# EasyEDA Pro project Custom PCB Keychain.epro

# Board PCB1
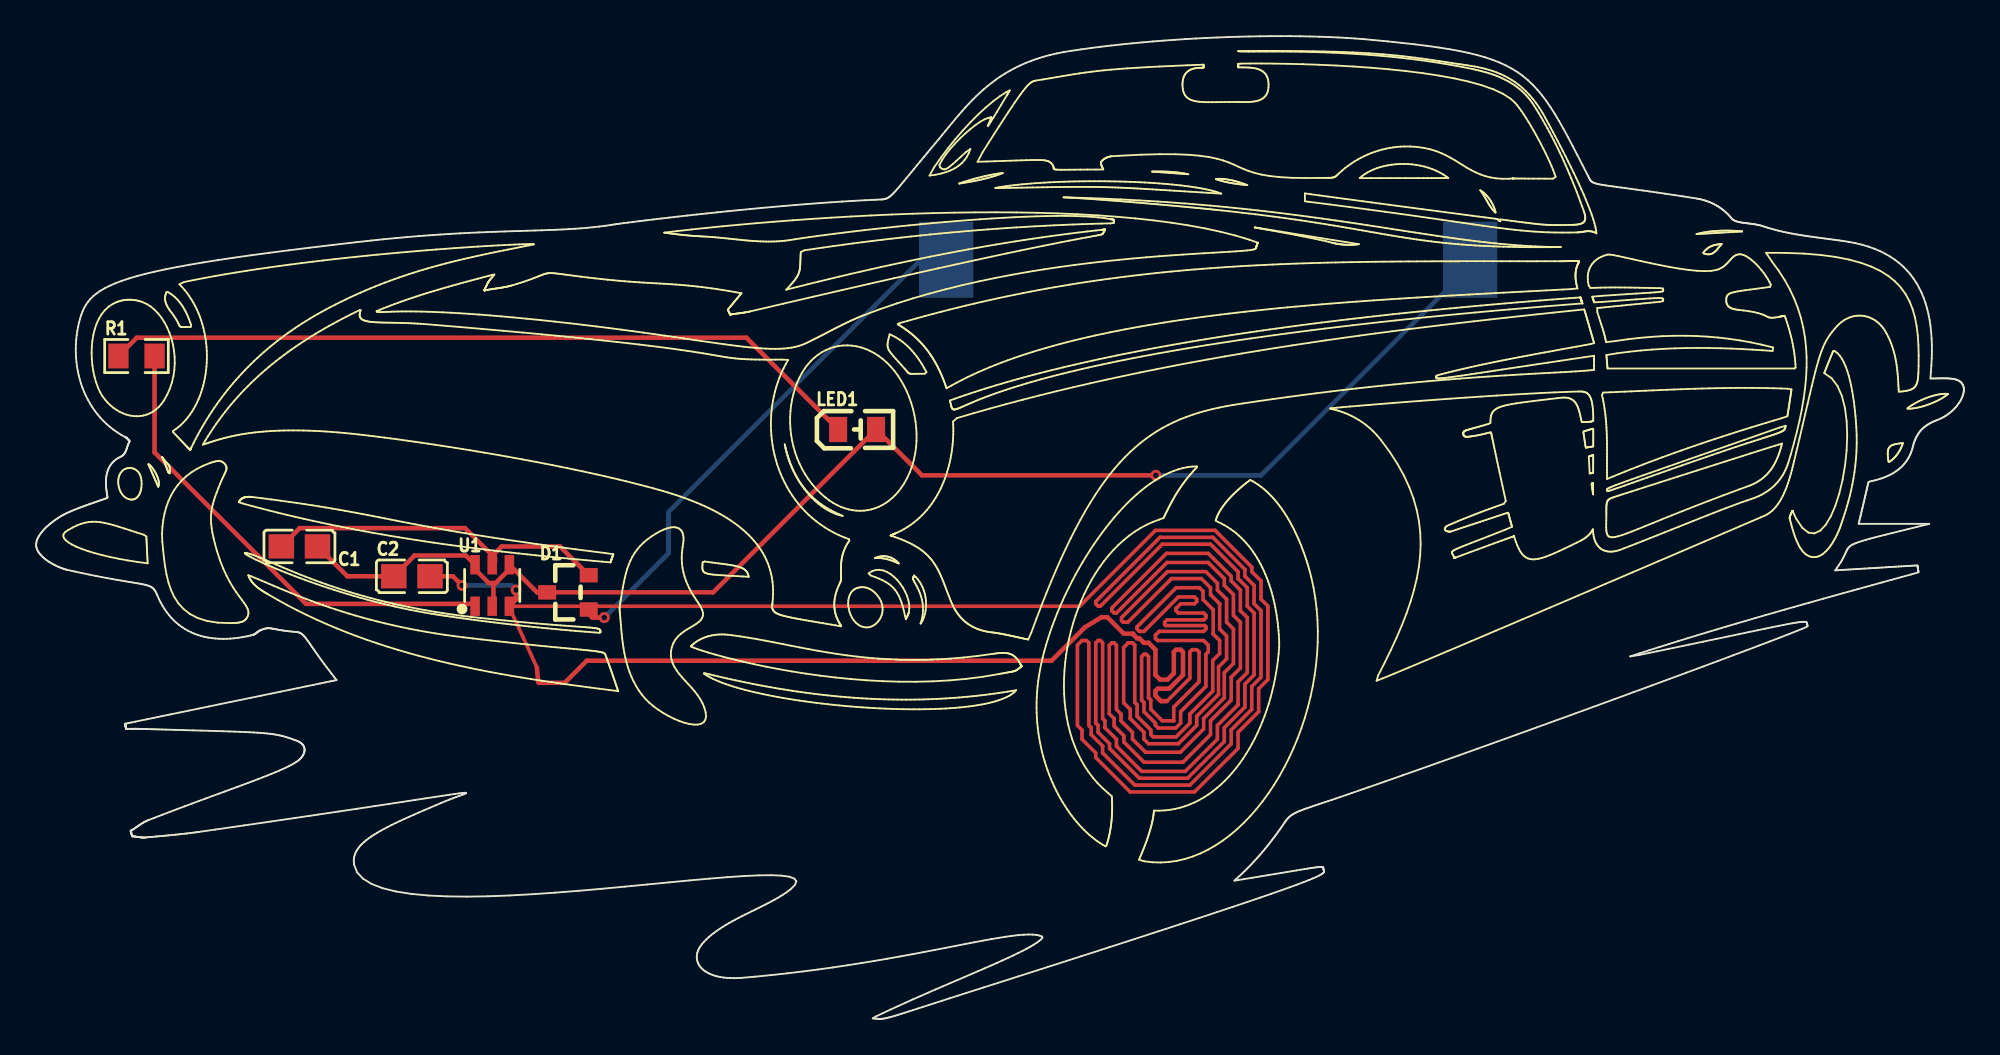
[diagram p0: board, top side]
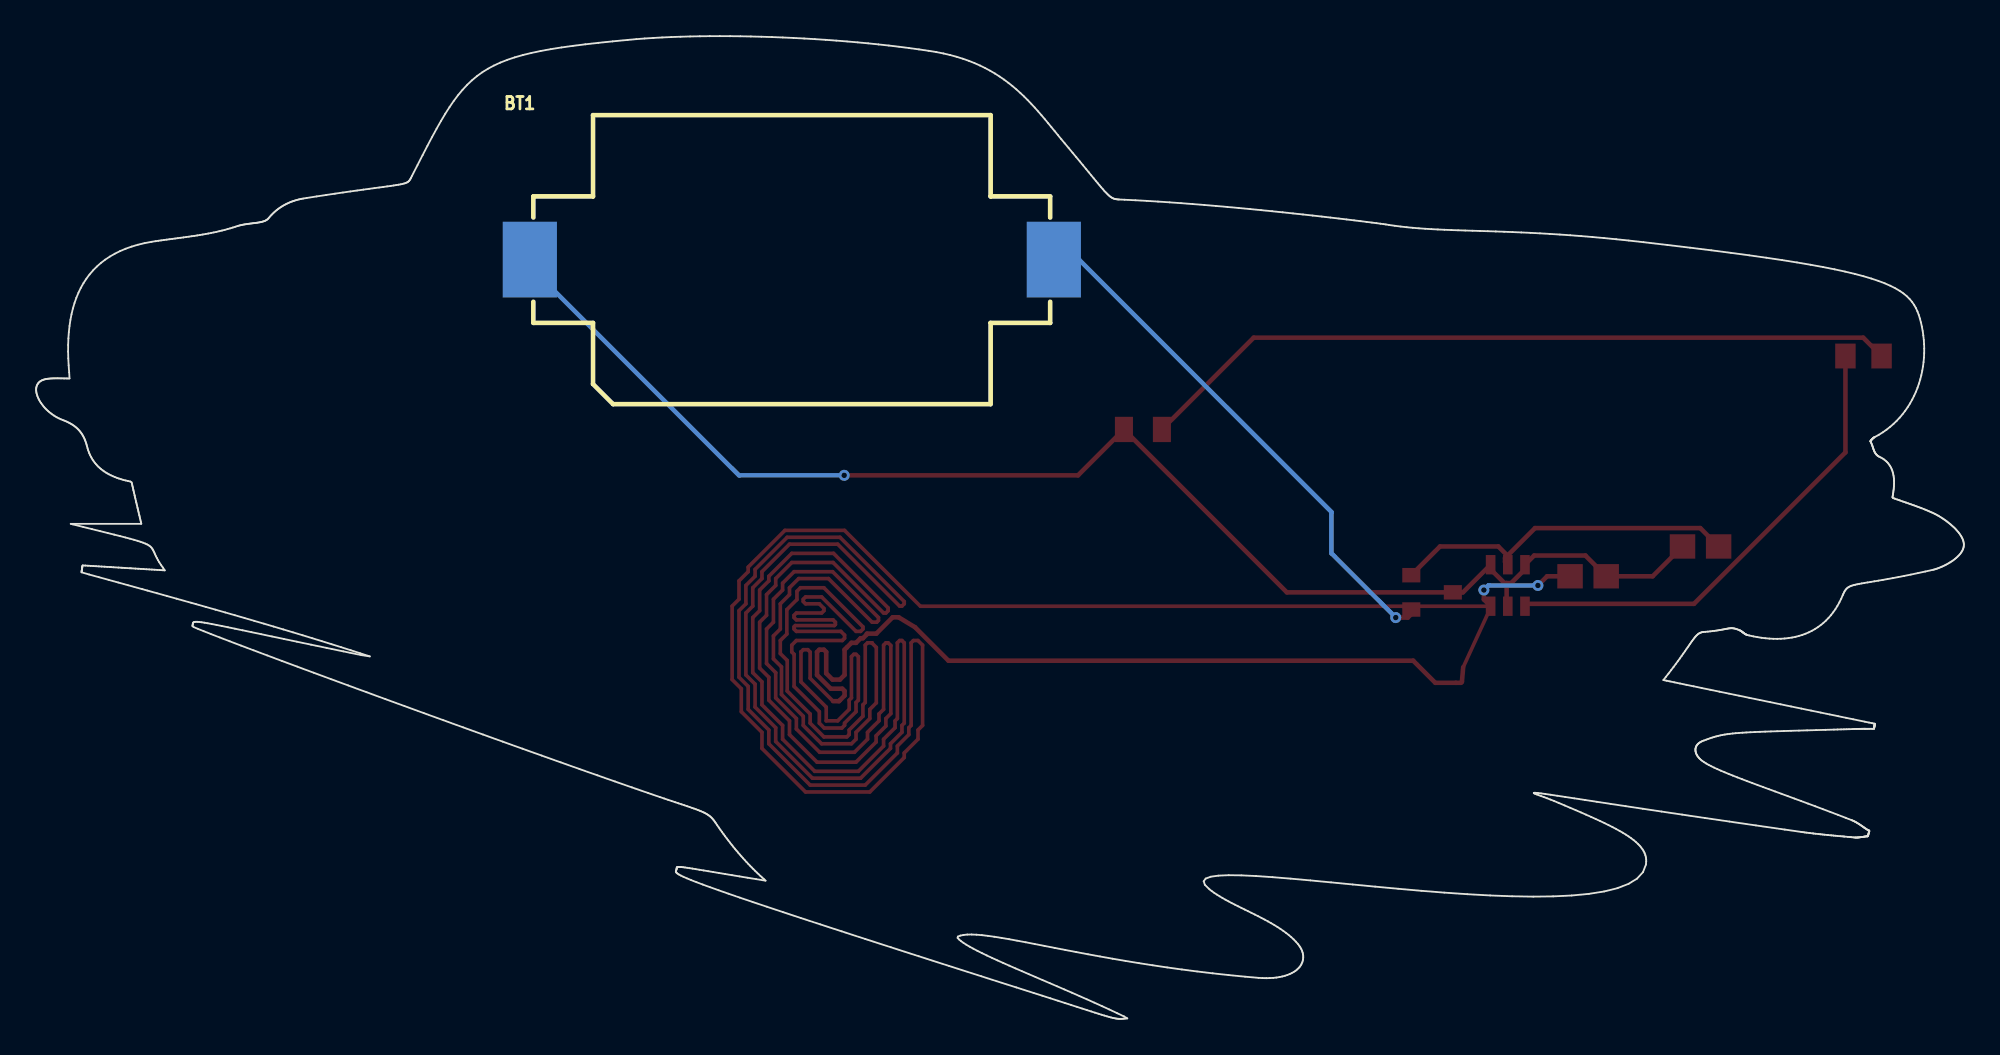
[diagram p1: board, bottom side, seen from below]

Outline 106.68 x 54.4 mm; copper layers: Top Layer, Bottom Layer. Coordinates in mm from the lower left corner of the outline.
Outline path: 0,26.24 0,26.17 0.02,26.1 0.03,26.04 0.06,25.97 0.09,25.91 0.12,25.85 0.16,25.79 0.21,25.73 0.26,25.67 0.31,25.62 0.37,25.56 0.43,25.51 0.5,25.45 0.56,25.4 0.63,25.35 0.7,25.31 0.77,25.26 0.84,25.22 0.92,25.18 0.99,25.14 1.06,25.1 1.14,25.06 1.21,25.03 1.28,25 1.35,24.97 1.42,24.95 1.48,24.92 1.54,24.9 1.6,24.88 1.66,24.87 1.71,24.86 2.13,24.76 2.55,24.67 2.94,24.59 3.29,24.52 3.63,24.45 3.94,24.39 4.22,24.34 4.49,24.3 4.73,24.26 4.95,24.22 5.33,24.16 5.5,24.13 5.65,24.1 5.78,24.08 5.9,24.05 6.01,24.03 6.11,24.01 6.19,23.98 6.27,23.95 6.33,23.92 6.39,23.89 6.44,23.86 6.49,23.81 6.53,23.77 6.57,23.72 6.6,23.66 6.64,23.59 6.67,23.52 6.71,23.44 6.79,23.26 6.89,23.05 7,22.86 7.11,22.67 7.23,22.5 7.36,22.34 7.49,22.19 7.63,22.05 7.78,21.91 7.93,21.79 8.08,21.68 8.24,21.57 8.41,21.48 8.58,21.39 8.76,21.32 8.94,21.25 9.13,21.19 9.32,21.15 9.51,21.11 9.71,21.08 9.91,21.05 10.12,21.04 10.33,21.03 10.54,21.04 10.76,21.05 10.98,21.07 11.2,21.09 11.42,21.13 11.65,21.17 11.88,21.22 11.97,21.24 11.99,21.25 12.01,21.26 12.04,21.27 12.06,21.28 12.09,21.29 12.1,21.3 12.13,21.32 12.17,21.35 12.22,21.38 12.23,21.39 12.24,21.4 12.26,21.41 12.27,21.42 12.31,21.45 12.33,21.47 12.36,21.48 12.39,21.5 12.42,21.51 12.48,21.54 12.53,21.56 12.58,21.58 12.63,21.59 12.67,21.6 12.71,21.61 12.75,21.62 12.79,21.62 12.83,21.62 12.87,21.62 12.91,21.62 12.95,21.62 12.99,21.61 13.04,21.61 13.08,21.6 13.13,21.59 13.19,21.58 13.31,21.56 13.45,21.53 13.53,21.52 13.62,21.5 13.71,21.49 13.81,21.48 13.92,21.46 14.04,21.45 14.16,21.44 14.3,21.42 14.41,21.41 14.46,21.41 14.51,21.4 14.56,21.38 14.6,21.36 14.64,21.34 14.68,21.32 14.72,21.28 14.77,21.25 14.81,21.21 14.85,21.16 14.89,21.11 14.94,21.05 14.99,20.98 15.04,20.91 15.16,20.75 15.22,20.66 15.29,20.56 15.36,20.46 15.44,20.34 15.53,20.22 15.62,20.09 15.72,19.95 15.83,19.8 15.94,19.64 16.07,19.48 16.2,19.3 16.34,19.12 16.49,18.92 16.63,18.75 16.45,18.72 16.26,18.68 16.01,18.63 15.71,18.56 15.35,18.49 14.95,18.41 14.51,18.31 14.03,18.22 13.53,18.11 12.99,18 12.44,17.89 11.88,17.77 11.3,17.65 10.72,17.53 10.14,17.41 9.56,17.29 9,17.18 8.45,17.06 7.92,16.95 7.42,16.85 6.95,16.75 6.52,16.66 6.12,16.58 5.49,16.45 5.25,16.4 5.07,16.37 4.93,16.34 4.94,16.3 4.94,16.25 4.95,16.2 4.96,16.16 4.96,16.13 4.96,16.11 4.97,16.08 4.97,16.05 5.05,16.05 5.19,16.05 5.31,16.05 5.35,16.05 5.39,16.06 5.43,16.06 5.47,16.06 5.57,16.06 5.64,16.05 5.72,16.05 5.76,16.05 5.82,16.05 5.88,16.05 5.95,16.05 6.04,16.04 6.13,16.04 6.35,16.03 6.49,16.03 6.64,16.03 6.8,16.02 6.99,16.02 7.19,16.01 7.65,16 8.18,15.98 8.67,15.97 9.13,15.96 9.56,15.94 9.96,15.93 10.33,15.92 10.68,15.91 10.99,15.9 11.29,15.89 11.56,15.88 11.81,15.86 12.04,15.85 12.25,15.84 12.45,15.83 12.63,15.81 12.8,15.8 12.95,15.78 13.09,15.76 13.23,15.74 13.35,15.72 13.47,15.69 13.59,15.67 13.7,15.64 13.81,15.61 13.92,15.57 14.03,15.54 14.14,15.5 14.26,15.45 14.38,15.41 14.47,15.38 14.51,15.36 14.56,15.33 14.6,15.31 14.64,15.28 14.67,15.25 14.7,15.23 14.73,15.2 14.76,15.17 14.78,15.14 14.8,15.1 14.82,15.07 14.83,15.03 14.84,15 14.85,14.96 14.85,14.93 14.86,14.89 14.85,14.85 14.85,14.81 14.84,14.78 14.83,14.74 14.82,14.7 14.8,14.66 14.78,14.62 14.76,14.58 14.74,14.54 14.71,14.5 14.68,14.47 14.64,14.43 14.61,14.39 14.56,14.34 14.47,14.28 14.37,14.21 14.26,14.13 14.13,14.06 13.98,13.98 13.82,13.91 13.64,13.82 13.45,13.74 13.24,13.65 13.02,13.56 12.79,13.47 12.54,13.37 12.28,13.27 12,13.16 11.72,13.06 11.42,12.94 11.11,12.83 10.79,12.71 10.45,12.59 10.11,12.46 9.75,12.33 9.38,12.2 9,12.06 8.62,11.91 8.22,11.77 7.81,11.61 7.4,11.46 6.97,11.29 6.54,11.13 6.21,11 6.14,10.97 6.11,10.96 6.04,10.92 5.98,10.89 5.92,10.85 5.89,10.84 5.83,10.8 5.8,10.78 5.71,10.72 5.65,10.68 5.62,10.66 5.59,10.64 5.56,10.62 5.51,10.59 5.47,10.56 5.44,10.54 5.38,10.5 5.32,10.46 5.29,10.44 5.25,10.42 5.24,10.41 5.24,10.4 5.24,10.38 5.25,10.35 5.27,10.29 5.28,10.25 5.28,10.21 5.3,10.15 5.3,10.13 5.31,10.12 5.32,10.11 5.33,10.11 5.36,10.11 5.41,10.1 5.48,10.09 5.66,10.06 5.68,10.06 5.71,10.06 5.75,10.05 5.77,10.05 5.79,10.05 5.86,10.04 5.88,10.04 5.92,10.04 5.95,10.04 5.98,10.04 6,10.04 6.04,10.04 6.12,10.05 6.61,10.09 7.01,10.13 7.11,10.14 7.51,10.17 7.71,10.19 7.81,10.2 7.91,10.21 8.21,10.25 8.31,10.26 8.51,10.28 8.71,10.31 8.81,10.32 8.91,10.33 9.01,10.35 9.91,10.48 11.51,10.71 12.98,10.92 14.34,11.12 15.59,11.31 16.73,11.47 17.77,11.63 18.71,11.77 19.55,11.9 20.31,12.02 20.97,12.12 22.07,12.28 22.5,12.35 22.86,12.4 23.16,12.45 23.4,12.48 23.57,12.5 23.7,12.51 23.77,12.51 23.8,12.51 23.79,12.49 23.74,12.46 23.65,12.43 23.54,12.39 23.4,12.33 23.24,12.28 23.06,12.21 22.87,12.14 22.68,12.06 22.43,11.95 22.1,11.82 21.78,11.68 21.48,11.55 21.18,11.42 20.9,11.3 20.63,11.18 20.37,11.06 20.12,10.95 19.89,10.84 19.66,10.73 19.45,10.62 19.25,10.51 19.06,10.41 18.88,10.3 18.71,10.2 18.55,10.1 18.41,10 18.27,9.89 18.15,9.79 18.04,9.69 17.94,9.59 17.86,9.49 17.78,9.38 17.72,9.28 17.67,9.17 17.63,9.06 17.6,8.95 17.58,8.84 17.58,8.73 17.59,8.54 17.76,8.12 18.08,7.76 18.56,7.47 19.17,7.23 19.91,7.05 20.75,6.92 21.7,6.83 22.73,6.78 23.83,6.77 25,6.78 26.22,6.83 27.47,6.9 28.74,6.99 30.03,7.09 31.31,7.2 32.58,7.32 33.82,7.44 35.02,7.55 36.17,7.66 37.25,7.76 38.26,7.84 39.17,7.91 39.99,7.94 40.68,7.95 41.25,7.93 41.68,7.87 41.96,7.76 42.07,7.62 42,7.42 41.75,7.17 41.62,7.07 41.48,6.97 41.34,6.88 41.19,6.78 41.03,6.69 40.86,6.6 40.7,6.51 40.52,6.41 40.35,6.32 40.17,6.23 39.99,6.14 39.62,5.96 39.43,5.87 39.24,5.78 39.06,5.68 38.87,5.59 38.69,5.49 38.51,5.4 38.33,5.29 38.16,5.19 37.99,5.09 37.82,4.98 37.67,4.87 37.51,4.76 37.36,4.64 37.22,4.52 37.09,4.4 36.97,4.27 36.85,4.14 36.78,4.05 36.72,3.95 36.67,3.86 36.63,3.77 36.59,3.67 36.57,3.58 36.56,3.49 36.56,3.39 36.57,3.3 36.59,3.21 36.61,3.13 36.65,3.04 36.7,2.96 36.76,2.88 36.82,2.8 36.9,2.73 36.99,2.66 37.09,2.59 37.19,2.53 37.31,2.48 37.44,2.43 37.58,2.38 37.72,2.34 37.88,2.31 38.05,2.29 38.22,2.27 38.41,2.26 38.61,2.25 38.81,2.26 39.03,2.27 39.78,2.34 40.69,2.42 41.57,2.52 42.44,2.62 43.28,2.73 44.09,2.85 44.88,2.97 45.65,3.09 46.4,3.21 47.11,3.33 47.81,3.45 48.48,3.58 49.12,3.7 49.73,3.81 50.32,3.93 50.88,4.04 51.41,4.14 51.92,4.24 52.4,4.33 52.84,4.41 53.26,4.48 53.65,4.54 54.01,4.59 54.34,4.63 54.64,4.66 54.91,4.67 55.15,4.67 55.36,4.65 55.53,4.61 55.67,4.55 55.69,4.48 55.61,4.4 55.5,4.31 55.36,4.21 55.2,4.11 55.02,4 54.81,3.88 54.59,3.76 54.34,3.64 54.07,3.51 53.78,3.38 53.48,3.24 53.16,3.09 52.83,2.95 52.48,2.79 52.12,2.64 51.75,2.48 51.37,2.32 50.98,2.15 50.59,1.98 50.19,1.81 49.78,1.63 49.37,1.45 48.95,1.27 48.54,1.09 48.12,0.9 47.71,0.71 47.3,0.52 46.89,0.33 46.48,0.14 46.3,0.03 46.38,0.02 46.45,0.01 46.51,0.01 46.58,0 46.63,0 46.69,0 46.75,0 46.81,0 46.87,0.01 46.94,0.02 47.02,0.04 47.1,0.06 47.2,0.08 47.31,0.11 47.43,0.14 47.56,0.18 47.72,0.23 47.89,0.28 48.08,0.34 48.3,0.41 48.53,0.49 48.8,0.57 49.09,0.67 49.4,0.77 49.75,0.88 50.13,1 50.55,1.14 51,1.28 51.48,1.44 52.43,1.74 54.37,2.36 56.17,2.93 57.84,3.47 59.38,3.96 60.8,4.42 62.1,4.84 63.29,5.23 64.37,5.59 65.36,5.91 66.24,6.21 67.03,6.47 67.74,6.71 68.36,6.93 68.91,7.12 69.39,7.29 69.8,7.44 70.14,7.57 70.43,7.68 70.67,7.78 70.86,7.86 71,7.93 71.11,7.99 71.19,8.04 71.24,8.09 71.27,8.12 71.28,8.16 71.28,8.19 71.27,8.21 71.25,8.24 71.24,8.27 71.24,8.29 71.23,8.31 71.23,8.33 71.23,8.35 71.23,8.37 71.22,8.38 71.21,8.39 71.19,8.4 71.17,8.41 71.13,8.41 71.09,8.41 71.03,8.41 70.96,8.4 70.87,8.39 70.77,8.38 70.65,8.36 70.52,8.34 70.36,8.32 70.18,8.29 69.97,8.25 69.74,8.22 69.49,8.17 69.2,8.13 68.89,8.07 68.55,8.02 68.17,7.95 67.76,7.89 67.32,7.81 66.83,7.73 66.32,7.65 66.4,7.74 66.5,7.82 66.6,7.92 66.7,8.01 66.8,8.1 66.89,8.19 66.99,8.29 67.09,8.39 67.18,8.48 67.28,8.58 67.37,8.68 67.46,8.79 67.56,8.89 67.65,8.99 67.74,9.1 67.83,9.2 67.92,9.31 68.02,9.42 68.11,9.53 68.2,9.65 68.29,9.76 68.37,9.87 68.46,9.99 68.55,10.11 68.64,10.23 68.73,10.35 68.82,10.47 68.9,10.59 68.99,10.72 69.08,10.84 69.12,10.91 69.16,10.97 69.2,11.02 69.24,11.07 69.29,11.12 69.33,11.16 69.38,11.2 69.42,11.24 69.48,11.28 69.53,11.31 69.59,11.35 69.66,11.39 69.72,11.42 69.8,11.45 69.88,11.49 69.97,11.53 70.06,11.56 70.16,11.6 70.27,11.64 70.39,11.68 70.52,11.73 70.66,11.77 70.81,11.82 70.96,11.88 71.13,11.93 71.32,11.99 71.51,12.06 71.71,12.13 71.93,12.2 72.17,12.28 72.82,12.5 73.71,12.81 74.65,13.14 75.62,13.48 76.62,13.83 77.65,14.2 78.7,14.58 79.78,14.96 80.86,15.35 81.95,15.74 83.04,16.13 84.14,16.53 85.22,16.92 86.3,17.31 87.35,17.7 88.39,18.08 89.4,18.45 90.38,18.81 91.33,19.16 92.23,19.5 93.09,19.82 93.89,20.12 94.65,20.4 95.34,20.66 95.97,20.9 96.52,21.11 97.01,21.3 97.41,21.46 97.73,21.59 97.96,21.69 98.03,21.74 98.02,21.79 98.02,21.83 98.01,21.86 98,21.9 97.99,21.92 97.97,21.95 97.94,21.96 97.9,21.97 97.84,21.98 97.76,21.98 97.66,21.97 97.53,21.95 97.37,21.93 97.19,21.9 96.96,21.86 96.71,21.81 96.41,21.75 96.07,21.68 95.69,21.6 95.25,21.51 94.77,21.41 93.63,21.17 92.97,21.03 92.25,20.88 91.47,20.71 90.61,20.53 89.69,20.34 88.69,20.14 88.22,20.06 88.74,20.23 89.27,20.41 89.8,20.57 90.34,20.74 90.87,20.91 91.4,21.07 91.93,21.23 92.47,21.4 93,21.56 93.54,21.72 94.08,21.87 94.61,22.03 95.15,22.19 95.68,22.34 96.22,22.5 96.76,22.65 97.3,22.8 97.83,22.96 98.91,23.26 99.45,23.41 99.99,23.56 100.52,23.71 101.6,24 102.14,24.15 102.68,24.3 103.21,24.45 103.75,24.6 104.17,24.72 104.16,24.78 104.16,24.81 104.15,24.87 104.14,24.91 104.14,24.95 104.12,25.05 104.12,25.08 104.1,25.1 103.96,25.09 103.81,25.08 103.66,25.07 103.36,25.05 103.21,25.05 103.06,25.04 102.9,25.03 102.75,25.02 102.4,25 102.12,24.98 101.97,24.97 101.5,24.94 101.19,24.92 101.03,24.91 100.88,24.91 100.73,24.9 100.58,24.89 100.42,24.88 100.28,24.87 100.13,24.86 99.98,24.85 99.84,24.84 99.7,24.83 99.56,24.83 99.67,24.98 99.77,25.13 99.87,25.27 99.94,25.4 100,25.51 100.05,25.62 100.1,25.71 100.14,25.8 100.17,25.87 100.2,25.94 100.24,26 100.28,26.06 100.33,26.11 100.39,26.17 100.46,26.21 100.54,26.26 100.64,26.31 100.76,26.36 100.9,26.41 101.07,26.46 101.26,26.52 101.49,26.58 101.74,26.65 102.03,26.72 102.36,26.8 102.72,26.89 103.13,27 103.58,27.11 104.08,27.23 104.63,27.37 104.76,27.4 100.86,27.4 100.87,27.45 100.89,27.53 100.91,27.61 100.93,27.7 100.95,27.78 100.98,27.9 101,28.02 101.02,28.1 101.04,28.18 101.06,28.26 101.1,28.41 101.12,28.49 101.14,28.57 101.19,28.8 101.21,28.88 101.22,28.95 101.26,29.1 101.28,29.18 101.3,29.29 101.33,29.4 101.34,29.47 101.36,29.55 101.38,29.62 101.39,29.69 101.47,29.74 101.6,29.77 101.73,29.8 101.86,29.83 101.98,29.87 102.1,29.91 102.22,29.95 102.33,29.99 102.44,30.04 102.54,30.09 102.64,30.14 102.74,30.19 102.83,30.25 102.92,30.3 103,30.36 103.08,30.43 103.16,30.49 103.23,30.56 103.31,30.63 103.37,30.71 103.43,30.78 103.49,30.86 103.55,30.94 103.6,31.03 103.65,31.11 103.69,31.2 103.73,31.3 103.77,31.39 103.81,31.49 103.84,31.59 103.86,31.68 103.88,31.76 103.9,31.83 103.93,31.9 103.95,31.97 103.98,32.04 104,32.1 104.03,32.16 104.06,32.23 104.09,32.28 104.13,32.34 104.16,32.39 104.2,32.45 104.24,32.5 104.28,32.55 104.32,32.6 104.37,32.64 104.41,32.69 104.46,32.73 104.51,32.77 104.56,32.81 104.62,32.85 104.67,32.89 104.73,32.92 104.79,32.96 104.86,32.99 104.92,33.03 104.99,33.06 105.06,33.09 105.13,33.12 105.21,33.15 105.32,33.19 105.42,33.24 105.51,33.29 105.61,33.34 105.7,33.4 105.79,33.46 105.87,33.52 105.95,33.59 106.03,33.65 106.11,33.72 106.17,33.8 106.24,33.87 106.3,33.94 106.36,34.02 106.42,34.09 106.46,34.17 106.51,34.25 106.55,34.33 106.58,34.4 106.61,34.48 106.64,34.55 106.66,34.62 106.67,34.7 106.68,34.77 106.68,34.83 106.68,34.9 106.67,34.96 106.65,35.02 106.63,35.08 106.6,35.13 106.58,35.17 106.55,35.2 106.52,35.23 106.49,35.26 106.45,35.29 106.41,35.31 106.37,35.34 106.33,35.36 106.29,35.37 106.24,35.39 106.19,35.4 106.14,35.41 106.09,35.42 106.03,35.43 105.97,35.44 105.91,35.44 105.85,35.45 105.78,35.45 105.72,35.45 105.65,35.45 105.57,35.45 105.5,35.45 105.42,35.45 105.35,35.45 105.27,35.45 105.18,35.45 105.01,35.45 104.92,35.45 104.83,35.45 104.85,35.78 104.88,36.18 104.9,36.56 104.91,36.94 104.91,37.3 104.9,37.66 104.87,38.01 104.83,38.35 104.78,38.69 104.72,39.01 104.65,39.32 104.56,39.62 104.45,39.91 104.34,40.19 104.21,40.46 104.06,40.72 103.9,40.97 103.72,41.2 103.53,41.43 103.33,41.64 103.1,41.83 102.86,42.02 102.6,42.19 102.33,42.35 102.04,42.5 101.72,42.63 101.4,42.75 101.05,42.85 100.68,42.94 100.3,43.01 100.07,43.05 99.92,43.07 99.76,43.09 99.61,43.11 99.46,43.13 99.3,43.15 99.15,43.17 98.99,43.19 98.84,43.21 98.69,43.23 98.53,43.25 98.38,43.28 98.23,43.3 98.07,43.32 97.92,43.34 97.77,43.36 97.61,43.39 97.46,43.41 97.31,43.44 97.15,43.47 97,43.5 96.85,43.53 96.7,43.56 96.55,43.6 96.4,43.63 96.25,43.67 96.1,43.71 95.95,43.75 95.8,43.8 95.65,43.85 95.54,43.88 95.48,43.9 95.41,43.92 95.34,43.94 95.27,43.95 95.2,43.97 95.13,43.98 95.06,43.99 94.99,44 94.92,44.01 94.85,44.02 94.78,44.03 94.72,44.03 94.65,44.04 94.58,44.05 94.52,44.06 94.46,44.07 94.39,44.08 94.33,44.09 94.28,44.1 94.22,44.11 94.17,44.12 94.12,44.14 94.07,44.15 94.02,44.17 93.98,44.19 93.94,44.21 93.9,44.24 93.87,44.26 93.84,44.29 93.8,44.33 93.75,44.39 93.7,44.45 93.65,44.51 93.6,44.56 93.54,44.61 93.49,44.66 93.43,44.71 93.37,44.76 93.31,44.81 93.25,44.85 93.19,44.89 93.13,44.94 93.07,44.98 93,45.02 92.94,45.05 92.87,45.09 92.8,45.12 92.73,45.15 92.66,45.18 92.59,45.21 92.52,45.24 92.45,45.27 92.37,45.29 92.3,45.31 92.22,45.34 92.14,45.36 92.07,45.37 91.99,45.39 91.91,45.41 91.71,45.44 91.15,45.52 90.63,45.6 90.15,45.67 89.7,45.74 89.29,45.8 88.92,45.85 88.57,45.9 88.25,45.94 87.96,45.98 87.7,46.02 87.47,46.05 87.25,46.08 87.07,46.1 86.9,46.13 86.75,46.15 86.62,46.17 86.51,46.19 86.41,46.21 86.33,46.24 86.25,46.26 86.19,46.28 86.14,46.31 86.1,46.33 86.06,46.36 86.03,46.4 86,46.43 85.98,46.47 85.95,46.52 85.93,46.57 85.87,46.67 85.58,47.26 85.29,47.81 85.02,48.33 84.77,48.82 84.52,49.27 84.28,49.7 84.04,50.09 83.81,50.46 83.57,50.81 83.33,51.13 83.08,51.42 82.83,51.7 82.57,51.95 82.29,52.18 81.99,52.39 81.68,52.59 81.35,52.77 80.99,52.93 80.61,53.08 80.19,53.22 79.75,53.35 79.27,53.47 78.76,53.57 78.21,53.67 77.61,53.77 76.98,53.86 76.29,53.94 75.56,54.03 74.78,54.11 73.94,54.19 73.46,54.23 73,54.26 72.53,54.3 72.04,54.32 71.54,54.34 71.02,54.36 70.49,54.38 69.95,54.39 69.4,54.39 68.84,54.4 68.28,54.39 67.71,54.39 67.13,54.38 66.54,54.36 65.96,54.34 65.36,54.32 64.77,54.3 64.18,54.26 63.58,54.23 62.99,54.19 62.4,54.15 61.81,54.1 61.22,54.05 60.64,54 60.06,53.94 59.49,53.87 58.93,53.81 58.37,53.74 57.83,53.66 57.29,53.58 56.86,53.51 56.47,53.44 56.1,53.35 55.74,53.25 55.39,53.14 55.07,53.03 54.75,52.9 54.45,52.77 54.16,52.63 53.89,52.48 53.62,52.32 53.36,52.16 53.12,51.99 52.88,51.82 52.65,51.63 52.43,51.45 52.22,51.25 52.01,51.06 51.81,50.86 51.61,50.65 51.42,50.44 51.23,50.23 51.05,50.02 50.86,49.8 50.68,49.58 50.5,49.36 50.31,49.14 50.13,48.92 49.95,48.69 49.76,48.47 49.55,48.21 49.32,47.94 49.12,47.7 48.92,47.46 48.75,47.25 48.58,47.05 48.43,46.86 48.29,46.69 48.16,46.53 48.04,46.39 47.93,46.25 47.83,46.13 47.74,46.03 47.65,45.93 47.57,45.84 47.5,45.76 47.44,45.69 47.37,45.63 47.32,45.58 47.26,45.53 47.21,45.49 47.16,45.46 47.12,45.44 47.07,45.41 47.02,45.4 46.97,45.38 46.93,45.37 46.87,45.36 46.82,45.36 46.76,45.35 46.45,45.34 45.84,45.31 45.22,45.28 44.59,45.24 43.96,45.2 43.32,45.15 42.68,45.1 42.04,45.05 41.39,45 40.76,44.94 40.13,44.88 39.5,44.82 38.89,44.76 38.29,44.7 37.7,44.64 37.13,44.58 36.57,44.52 36.04,44.47 35.53,44.41 35.04,44.35 34.58,44.3 34.15,44.25 33.75,44.2 33.38,44.15 33.05,44.11 32.75,44.08 32.5,44.04 32.28,44.01 32.11,43.99 31.98,43.97 31.82,43.95 31.49,43.9 31.17,43.86 30.83,43.82 30.5,43.79 30.16,43.76 29.82,43.73 29.47,43.71 29.11,43.69 28.74,43.68 28.37,43.66 27.99,43.65 27.6,43.64 27.19,43.62 26.78,43.61 26.35,43.6 25.91,43.58 25.45,43.57 24.98,43.55 24.49,43.53 23.98,43.51 23.46,43.48 22.92,43.45 22.36,43.41 21.78,43.37 21.18,43.33 20.56,43.28 19.91,43.22 19.24,43.15 18.55,43.08 17.72,42.99 16.4,42.84 15.15,42.69 13.99,42.54 12.9,42.4 11.88,42.26 10.93,42.13 10.05,42 9.23,41.87 8.48,41.74 7.79,41.61 7.15,41.49 6.57,41.36 6.04,41.23 5.56,41.11 5.12,40.98 4.73,40.85 4.38,40.72 4.07,40.58 3.8,40.44 3.55,40.3 3.34,40.15 3.16,40 3,39.85 2.87,39.68 2.75,39.52 2.65,39.34 2.57,39.16 2.5,38.97 2.44,38.77 2.38,38.56 2.32,38.32 2.28,38.08 2.24,37.83 2.22,37.59 2.2,37.34 2.19,37.09 2.2,36.85 2.21,36.6 2.23,36.36 2.26,36.11 2.3,35.87 2.35,35.63 2.41,35.4 2.48,35.16 2.56,34.94 2.65,34.71 2.75,34.49 2.86,34.27 2.98,34.06 3.11,33.86 3.25,33.66 3.39,33.47 3.55,33.28 3.72,33.1 3.89,32.93 4.08,32.77 4.28,32.61 4.48,32.47 4.7,32.33 4.93,32.2 4.97,32.19 4.99,32.17 5.01,32.15 5.04,32.13 5.07,32.1 5.09,32.08 5.11,32.05 5.14,32.02 5.15,32 5.17,31.97 5.16,31.94 5.14,31.91 5.13,31.88 5.11,31.85 5.1,31.81 5.09,31.78 5.06,31.72 5.04,31.65 5.03,31.62 5.01,31.55 5,31.52 4.99,31.49 4.97,31.46 4.96,31.43 4.95,31.4 4.93,31.37 4.92,31.34 4.9,31.31 4.88,31.29 4.86,31.26 4.84,31.24 4.82,31.21 4.79,31.19 4.77,31.17 4.74,31.15 4.71,31.13 4.67,31.11 4.6,31.08 4.5,31.02 4.41,30.96 4.33,30.89 4.25,30.82 4.19,30.75 4.13,30.67 4.08,30.59 4.03,30.51 3.99,30.43 3.96,30.34 3.93,30.25 3.91,30.17 3.89,30.08 3.88,29.99 3.87,29.9 3.86,29.81 3.86,29.72 3.86,29.63 3.87,29.55 3.87,29.47 3.88,29.38 3.89,29.31 3.89,29.23 3.9,29.16 3.91,29.09 3.93,28.97 3.94,28.92 3.95,28.87 3.92,28.83 3.85,28.8 3.69,28.75 3.61,28.72 3.38,28.64 3.3,28.61 3.23,28.59 3.07,28.53 2.99,28.5 2.91,28.48 2.84,28.45 2.76,28.42 2.68,28.39 2.6,28.36 2.52,28.34 2.45,28.31 2.37,28.28 2.22,28.22 2.14,28.19 2.06,28.16 1.99,28.12 1.91,28.09 1.83,28.06 1.76,28.02 1.68,27.99 1.61,27.96 1.56,27.93 1.5,27.89 1.43,27.86 1.37,27.82 1.3,27.78 1.23,27.73 1.15,27.69 1.08,27.64 1.01,27.58 0.93,27.53 0.86,27.47 0.78,27.41 0.71,27.35 0.64,27.29 0.57,27.22 0.5,27.16 0.44,27.09 0.38,27.02 0.32,26.95 0.26,26.88 0.21,26.81 0.16,26.74 0.12,26.67 0.09,26.6 0.06,26.53 0.03,26.45 0.01,26.38 0,26.31 0,26.24
Stack: Top Layer 0.035mm / Dielectric1 1.51mm FR4 er 4.5 / Bottom Layer 0.035mm

## Design rules (mm)
template: JLCPCB Capability(Two Layers Board)
spacing copperThickness1oz (default): track to track 0.102, other pairs 0.152 to 0.3
spacing copperThickness2oz: track to track 0.203, other pairs 0.152 to 0.3
track width copperThickness1oz (default): min 0.127, default 0.254, max 2.54
track width copperThickness2oz: min 0.203, default 0.254, max 2.54
differential pair differentialPair (default): width min 0.127, default 0.254, max 2.54; gap min 0.152, default 0.152
via viaSize (default): diameter min 0.5, default 0.61, max 10; hole min 0.3, default 0.305, max 6.3

## Placement (name value [footprint] x y rotation side)
BT1  XDCR-2032-603  [BAT-SMD_XDCR-2032-603]  64.86 42.02 180 bottom
C1  100nF  [C0805]  14.57 26.15 180 top
C2  22pF  [C0805]  20.79 24.5 0 top
D1  BAT54,215  [SOT-23_L2.9-W1.3-P1.90-LS2.4-BR]  29.43 23.61 0 top
LED1  YLED0805R  [LED0805-R-RD_RED]  45.43 32.63 0 top
R1  470Ω  [R0805]  5.55 36.69 0 top
U1  TTP223-BA6-TD  [SOT-23-6_L2.9-W1.6-P0.95-LS2.9-BL]  25.24 23.99 0 top

## Footprints (pads in the part's own frame, mm; a bottom-side part is the same pattern mirrored in y, then rotated)
BAT-SMD_XDCR-2032-603
  rect 3x4.2 smd: 1(-14.5,0) 2(14.5,0)
C0805
  rect 1.41x1.35 smd: 1(-1,0) 2(1,0)
LED0805-R-RD_RED
  rect 1x1.399 smd: 1(1.05,0) 2(-1.05,0)
R0805
  rect 1.133x1.377 smd: 1(-1,0) 2(1,0)
SOT-23-6_L2.9-W1.6-P0.95-LS2.9-BL
  rect 0.532x1.072 smd: 1(-0.95,-1.149) 2(0,-1.149) 3(0.95,-1.149) 4(0.95,1.149) 5(0,1.149) 6(-0.95,1.149)
SOT-23_L2.9-W1.3-P1.90-LS2.4-BR
  rect 1x0.8 smd: 1(1.15,-0.95) 2(1.15,0.95) 3(-1.15,0)

## Nets
GND: BT1.1 C1.1 C2.1 D1.3 LED1.1 U1.2 U1.4 U1.6
VDD/VCC: C1.2 D1.2 U1.5
$1N944: BT1.2 D1.1
$1N994: C2.2 U1.3
$1N1004: R1.2 U1.1
$1N1008: LED1.2 R1.1

## Via types
v1: diameter 0.61, hole 0.305, Top Layer to Bottom Layer, 4 vias

## Routing (per net, layer and track width the routed paths; a pad name or vN(x,y) marks a point on that pad's centre or on a via; arc(x,y) is an arc through that point)
GND: length 77.7
  Top Layer w0.254: 25.3,24.12 25.05,24.12 24.29,24.88 U1.6 23.78,25.65 20.94,25.65 C2.1 17.22,24.5 C1.1 ; 25.3,24.12 25.43,24.12 26.19,24.88 U1.4 27.72,23.61 37.46,23.61 LED1.1 49.02,30.09 v1(61.96,30.09) ; 25.3,24.12 25.3,22.91 U1.2
  Bottom Layer w0.254: v1(61.96,30.09) 67.78,30.09 79.26,41.56
VDD/VCC: length 19.6
  Top Layer w0.254: 25.25,25.64 25.76,26.15 28.99,26.15 D1.2 ; 25.25,25.64 23.73,27.16 14.59,27.16 C1.2 ; 25.25,25.64 25.39,25.5 25.39,25.29 U1.5
$1N944: length 397.9
  Top Layer w0.203: 27.71,19.46 26.19,22.76 26.19,22.84 57.74,22.84 61.94,27.04 65.24,27.04 67.28,25.01 67.28,24.75 67.78,24.24 67.78,23.23 68.16,22.85 68.16,18.78 67.66,18.27 67.66,17 66.51,15.86 66.51,14.97 64.1,12.56 60.54,12.56 58.64,14.46 58.64,14.72 57.88,15.48 57.88,15.99 57.62,16.24 57.62,20.69 57.88,20.94 58.13,20.94 58.26,20.81 58.26,16.24 58.39,16.12 58.39,15.73 59.02,15.1 59.02,14.72 60.8,12.94 63.85,12.94 66.13,15.23 66.13,15.99 67.28,17.13 67.28,18.4 67.78,18.91 67.78,22.59 67.4,22.97 67.4,23.99 66.89,24.5 66.89,24.88 65.12,26.66 62.2,26.66 58.64,23.1 58.64,22.97 58.77,22.85 58.89,22.85 62.32,26.28 64.99,26.28 66.51,24.75 66.51,24.37 67.02,23.86 67.02,22.85 67.4,22.47 67.4,19.04 66.89,18.53 66.89,17.26 65.75,16.12 65.75,15.35 63.72,13.32 61.05,13.32 59.4,14.97 59.4,15.23 58.77,15.86 58.77,16.24 58.64,16.37 58.64,20.81 58.77,20.94 58.89,20.94 59.02,20.81 59.02,16.62 59.15,16.5 59.15,16.12 59.78,15.48 59.78,15.1 61.18,13.7 63.59,13.7 65.37,15.48 65.37,16.24 66.51,17.39 66.51,18.66 67.02,19.16 67.02,22.21 66.64,22.59 66.64,23.74 66.13,24.24 66.13,24.5 64.86,25.77 62.55,25.77 59.53,22.74 59.53,22.59 59.66,22.47 59.78,22.47 62.58,25.26 64.86,25.26 65.75,24.37 65.75,23.99 66.26,23.48 66.26,22.34 66.64,21.96 66.64,19.42 66.13,18.91 66.13,17.64 64.99,16.5 64.99,15.73 63.47,14.21 61.31,14.21 60.2,15.32 60.2,15.67 59.66,16.21 59.66,16.62 59.38,16.9 59.38,20.67 59.53,20.81 59.66,20.81 59.78,20.69 59.78,17.13 60.04,16.88 60.04,16.5 60.67,15.86 60.67,15.48 61.39,14.76 63.32,14.76 64.61,16.05 64.61,16.62 65.75,17.77 65.75,19.16 66.26,19.67 66.26,21.58 65.88,21.96 65.88,23.23 65.37,23.74 65.37,24.12 64.74,24.75 62.61,24.75 60.06,22.21 60.06,22.06 60.16,21.96 60.42,21.96 62.83,24.37 64.48,24.37 64.99,23.86 64.99,23.48 65.5,22.97 65.5,21.58 65.88,21.2 65.88,19.93 65.43,19.48 65.43,17.96 64.23,16.75 64.23,16.24 63.21,15.23 61.56,15.23 61.31,15.48 61.31,15.86 60.54,16.62 60.54,17.13 60.18,17.49 60.18,20.56 60.42,20.79 60.42,20.81 60.67,20.81 60.8,20.69 60.8,17.51 60.93,17.39 60.93,16.75 61.69,15.99 61.69,15.73 61.81,15.61 63.08,15.61 63.85,16.37 63.85,16.88 65.12,18.15 65.12,19.84 65.5,20.22 65.5,20.94 65.14,21.3 65.14,22.65 64.58,23.21 64.58,23.67 64.38,23.86 63.08,23.86 60.93,21.7 60.93,21.58 61.05,21.45 61.31,21.45 63.21,23.35 64.1,23.35 64.23,23.23 64.23,23.1 64.1,22.97 63.34,22.97 63.08,22.72 63.08,22.59 63.21,22.47 64.61,22.47 64.74,22.34 64.74,22.21 64.61,22.08 62.58,22.08 62.45,21.96 62.45,21.83 62.51,21.77 64.67,21.77 64.74,21.7 64.74,21.58 64.61,21.45 62.15,21.45 61.94,21.24 61.94,21.07 62.07,20.94 64.61,20.94 64.86,20.69 64.86,20.31 64.74,20.18 64.74,18.4 63.34,17 63.34,16.37 63.07,16.1 62.09,16.1 61.94,16.25 61.94,16.37 61.31,17 61.31,17.51 61.18,17.64 61.18,20.05 61.31,20.18 61.43,20.18 61.56,20.05 61.56,17.77 61.69,17.64 61.69,17.13 62.32,16.5 62.96,16.5 62.96,17.26 64.35,18.66 64.35,20.32 64.34,20.32 64.23,20.43 63.97,20.43 63.85,20.31 63.85,18.85 62.58,17.58
  Top Layer w0.254: 27.71,19.46 27.78,18.66 27.83,18.6 29.25,18.6 30.47,19.83 56.19,19.83 58.04,21.68 58.95,22.23 59.28,22.23 60.18,21.32 60.7,21.32 60.7,21.29 60.93,21.07 61.05,21.07 61.31,20.81 61.56,20.81 61.94,20.43 61.94,19.04 62.2,18.78 62.61,18.78 62.96,19.13 62.96,20.31 63.08,20.43 63.34,20.43 63.47,20.31 63.47,19.04 62.7,18.27 62.07,18.27 61.94,18.15 61.94,17.89 62.25,17.58 62.58,17.58 ; v1(31.44,22.21) 30.77,22.21 30.58,22.4 D1.1
  Bottom Layer w0.254: 50.16,42.02 48.97,42.02 35,28.05 35,25.77 v1(31.44,22.21)
$1N994: length 6.1
  Top Layer w0.254: v1(26.56,23.74) 26.56,23.22 U1.3 ; v1(23.57,23.99) 23.06,24.5 C2.2
  Bottom Layer w0.254: v1(26.56,23.74) 26.31,23.99 v1(23.57,23.99)
$1N1004: length 26.6
  Top Layer w0.254: U1.1 24.16,22.97 14.94,22.97 6.55,31.36 R1.2
$1N1008: length 42.4
  Top Layer w0.254: R1.1 5.57,37.71 39.3,37.71 LED1.2
